# Altium schematic sheet Main_Core.SchDoc: PSDK&RFID_Ver_01
size A4; Date: 2020年12月23日
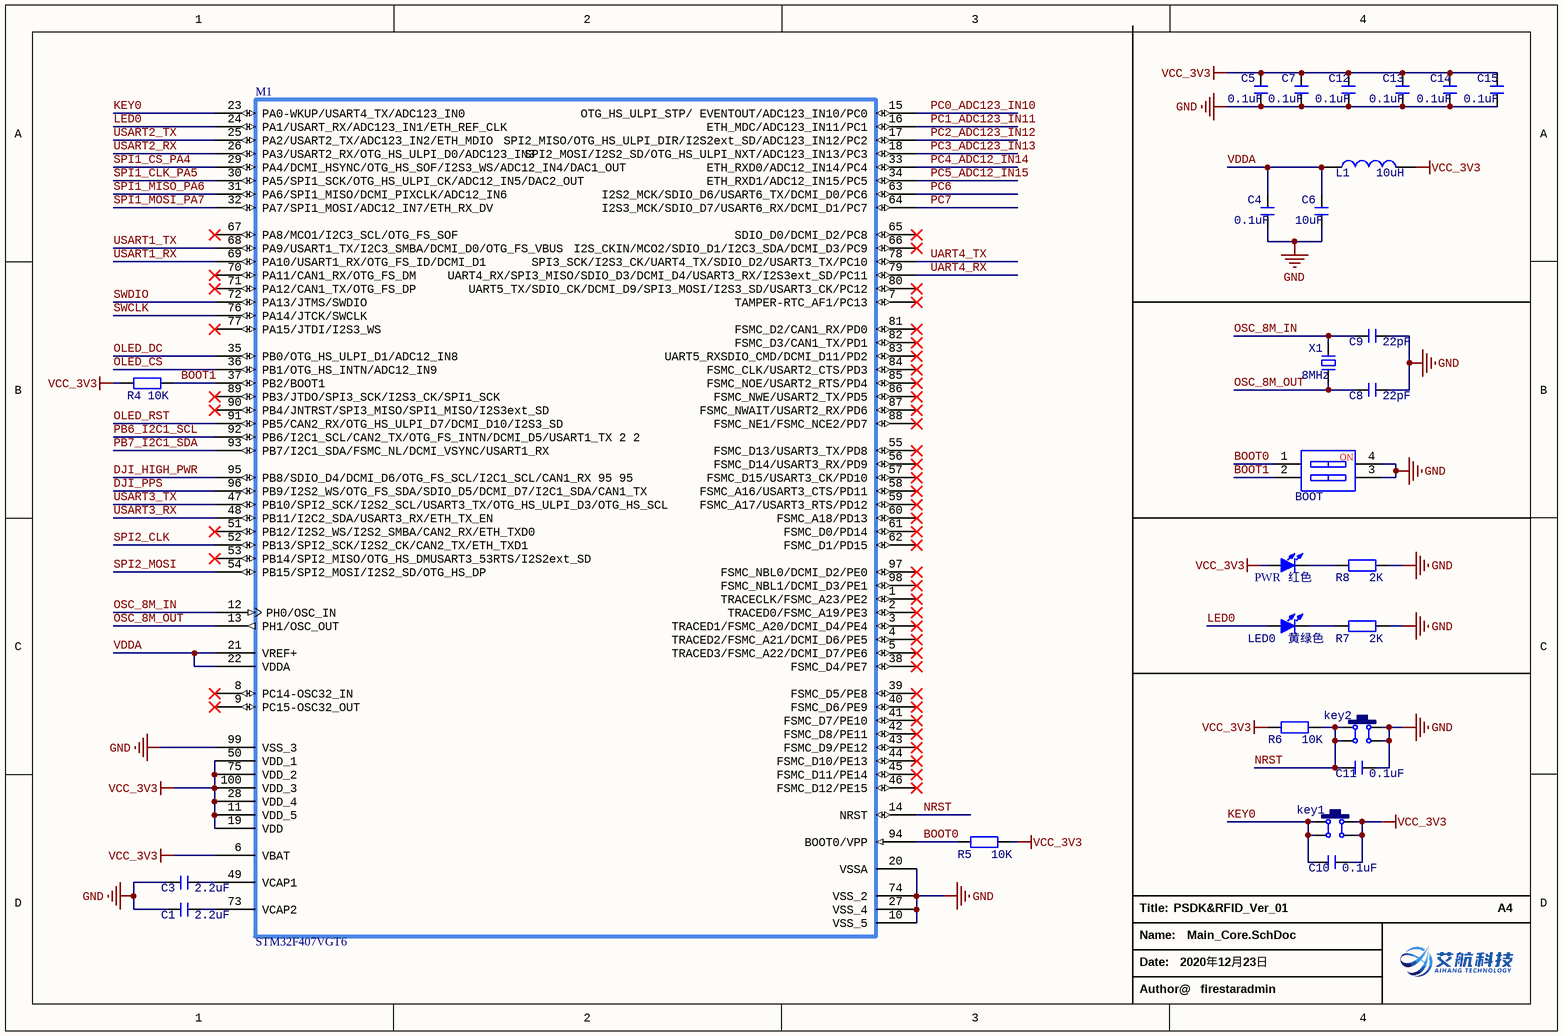
[diagram p0: Main_Core.SchDoc]

## Parts
BOOT  CSW-2P  [CSW1.27 SMD-2P]  (value not drawn)
C1  2.2uF  [C 0603_L]
C3  2.2uF  [C 0603_L]
C4  0.1uF  [C 0603_L]
C5  0.1uF  [C 0603_L]
C6  10uF  [C 0603_L]
C7  0.1uF  [C 0603_L]
C8  22pF  [C 0603_L]
C9  22pF  [C 0603_L]
C10  0.1uF  [C 0603_L]
C11  0.1uF  [C 0603_L]
C12  0.1uF  [C 0603_L]
C13  0.1uF  [C 0603_L]
C14  0.1uF  [C 0603_L]
C15  0.1uF  [C 0603_L]
key1  key  [TSMD-3*4*2.5]  (value not drawn)
key2  key  [TSMD-3*4*2.5]  (value not drawn)
L1  10uH  [L 0603]
LED0  黄绿色  [LED 0603G]
M1  STM32F407VGT6  [LQFP100 14x14_M]
PWR  红色  [LED 0603R]
R4  10K  [R 0603_L]
R5  10K  [R 0603_L]
R6  10K  [R 0603_L]
R7  2K  [R 0603_L]
R8  2K  [R 0603_L]
X1  8MHz  [OSC 5032-2P]

## Nets
GND: BOOT.3 BOOT.4 C1.2 C3.2 C4.1 C5.1 C6.1 C7.1 C8.1 C9.1 C11.1 C12.1 C13.1 C14.1 C15.1 key2.3 key2.4 M1.10(VSS_5) M1.20(VSSA) M1.27(VSS_4) M1.74(VSS_2) M1.99(VSS_3) R7.2 R8.2
VCC_3V3: C5.2 C7.2 C10.1 C12.2 C13.2 C14.2 C15.2 key1.3 key1.4 L1.2 M1.6(VBAT) M1.11(VDD_5) M1.19(VDD) M1.28(VDD_4) M1.50(VDD_1) M1.75(VDD_2) M1.100(VDD_3) PWR.1(A) R4.2 R5.2 R6.1
BOOT0: BOOT.1 M1.94(BOOT0/VPP) R5.1
BOOT1: BOOT.2 M1.37(PB2/BOOT1) R4.1
DJI_HIGH_PWR: M1.95(PB8/SDIO_D4/DCMI_D6/OTG_FS_SCL/I2C1_SCL/CAN1_RX_95_95)
DJI_PPS: M1.96(PB9/I2S2_WS/OTG_FS_SDA/SDIO_D5/DCMI_D7/I2C1_SDA/CAN1_TX)
KEY0: C10.2 key1.1 key1.2 M1.23(PA0-WKUP/USART4_TX/ADC123_IN0)
LED0: LED0.1(A) M1.24(PA1/USART_RX/ADC123_IN1/ETH_REF_CLK)
NRST: C11.2 key2.1 key2.2 M1.14(NRST) R6.2
OLED_CS: M1.36(PB1/OTG_HS_INTN/ADC12_IN9)
OLED_DC: M1.35(PB0/OTG_HS_ULPI_D1/ADC12_IN8)
OLED_RST: M1.91(PB5/CAN2_RX/OTG_HS_ULPI_D7/DCMI_D10/I2S3_SD)
OSC_8M_IN: C9.2 M1.12(PH0/OSC_IN) X1.2
OSC_8M_OUT: C8.2 M1.13(PH1/OSC_OUT) X1.1
PB6_I2C1_SCL: M1.92(PB6/I2C1_SCL/CAN2_TX/OTG_FS_INTN/DCMI_D5/USART1_TX_2_2)
PB7_I2C1_SDA: M1.93(PB7/I2C1_SDA/FSMC_NL/DCMI_VSYNC/USART1_RX)
PC0_ADC123_IN10: M1.15(OTG_HS_ULPI_STP/_EVENTOUT/ADC123_IN10/PC0)
PC1_ADC123_IN11: M1.16(ETH_MDC/ADC123_IN11/PC1)
PC2_ADC123_IN12: M1.17(SPI2_MISO/OTG_HS_ULPI_DIR/I2S2ext_SD/ADC123_IN12/PC2)
PC3_ADC123_IN13: M1.18(SPI2_MOSI/I2S2_SD/OTG_HS_ULPI_NXT/ADC123_IN13/PC3)
PC4_ADC12_IN14: M1.33(ETH_RXD0/ADC12_IN14/PC4)
PC5_ADC12_IN15: M1.34(ETH_RXD1/ADC12_IN15/PC5)
PC6: M1.63(I2S2_MCK/SDIO_D6/USART6_TX/DCMI_D0/PC6)
PC7: M1.64(I2S3_MCK/SDIO_D7/USART6_RX/DCMI_D1/PC7)
SPI1_CLK_PA5: M1.30(PA5/SPI1_SCK/OTG_HS_ULPI_CK/ADC12_IN5/DAC2_OUT)
SPI1_CS_PA4: M1.29(PA4/DCMI_HSYNC/OTG_HS_SOF/I2S3_WS/ADC12_IN4/DAC1_OUT)
SPI1_MISO_PA6: M1.31(PA6/SPI1_MISO/DCMI_PIXCLK/ADC12_IN6)
SPI1_MOSI_PA7: M1.32(PA7/SPI1_MOSI/ADC12_IN7/ETH_RX_DV)
SPI2_CLK: M1.52(PB13/SPI2_SCK/I2S2_CK/CAN2_TX/ETH_TXD1)
SPI2_MOSI: M1.54(PB15/SPI2_MOSI/I2S2_SD/OTG_HS_DP)
SWCLK: M1.76(PA14/JTCK/SWCLK)
SWDIO: M1.72(PA13/JTMS/SWDIO)
UART4_RX: M1.79(UART4_RX/SPI3_MISO/SDIO_D3/DCMI_D4/USART3_RX/I2S3ext_SD/PC11)
UART4_TX: M1.78(SPI3_SCK/I2S3_CK/UART4_TX/SDIO_D2/USART3_TX/PC10)
USART1_RX: M1.69(PA10/USART1_RX/OTG_FS_ID/DCMI_D1)
USART1_TX: M1.68(PA9/USART1_TX/I2C3_SMBA/DCMI_D0/OTG_FS_VBUS)
USART2_RX: M1.26(PA3/USART2_RX/OTG_HS_ULPI_D0/ADC123_IN3)
USART2_TX: M1.25(PA2/USART2_TX/ADC123_IN2/ETH_MDIO)
USART3_RX: M1.48(PB11/I2C2_SDA/USART3_RX/ETH_TX_EN)
USART3_TX: M1.47(PB10/SPI2_SCK/I2S2_SCL/USART3_TX/OTG_HS_ULPI_D3/OTG_HS_SCL)
VDDA: C4.2 C6.2 L1.1 M1.21(VREF+) M1.22(VDDA)
NetC1_1: C1.1 M1.73(VCAP2)
NetC3_1: C3.1 M1.49(VCAP1)
NetLED0_2: LED0.2(K) R7.1
NetPWR_2: PWR.2(K) R8.1

Not connected (* = marked no-connect by the designer): M1 1(TRACECLK/FSMC_A23/PE2)* 2(TRACED0/FSMC_A19/PE3)* 3(TRACED1/FSMC_A20/DCMI_D4/PE4)* 4(TRACED2/FSMC_A21/DCMI_D6/PE5)* 5(TRACED3/FSMC_A22/DCMI_D7/PE6)* 7(TAMPER-RTC_AF1/PC13)* 8(PC14-OSC32_IN)* 9(PC15-OSC32_OUT)* 38(FSMC_D4/PE7)* 39(FSMC_D5/PE8)* 40(FSMC_D6/PE9)* 41(FSMC_D7/PE10)* 42(FSMC_D8/PE11)* 43(FSMC_D9/PE12)* 44(FSMC_D10/PE13)* 45(FSMC_D11/PE14)* 46(FSMC_D12/PE15)* 51(PB12/I2S2_WS/I2S2_SMBA/CAN2_RX/ETH_TXD0)* 53(PB14/SPI2_MISO/OTG_HS_DMUSART3_53RTS/I2S2ext_SD)* 55(FSMC_D13/USART3_TX/PD8)* 56(FSMC_D14/USART3_RX/PD9)* 57(FSMC_D15/USART3_CK/PD10)* 58(FSMC_A16/USART3_CTS/PD11)* 59(FSMC_A17/USART3_RTS/PD12)* 60(FSMC_A18/PD13)* 61(FSMC_D0/PD14)* 62(FSMC_D1/PD15)* 65(SDIO_D0/DCMI_D2/PC8)* 66(I2S_CKIN/MCO2/SDIO_D1/I2C3_SDA/DCMI_D3/PC9)* 67(PA8/MCO1/I2C3_SCL/OTG_FS_SOF)* 70(PA11/CAN1_RX/OTG_FS_DM)* 71(PA12/CAN1_TX/OTG_FS_DP)* 77(PA15/JTDI/I2S3_WS)* 80(UART5_TX/SDIO_CK/DCMI_D9/SPI3_MOSI/I2S3_SD/USART3_CK/PC12)* 81(FSMC_D2/CAN1_RX/PD0)* 82(FSMC_D3/CAN1_TX/PD1)* 83(UART5_RXSDIO_CMD/DCMI_D11/PD2)* 84(FSMC_CLK/USART2_CTS/PD3)* 85(FSMC_NOE/USART2_RTS/PD4)* 86(FSMC_NWE/USART2_TX/PD5)* 87(FSMC_NWAIT/USART2_RX/PD6)* 88(FSMC_NE1/FSMC_NCE2/PD7)* 89(PB3/JTDO/SPI3_SCK/I2S3_CK/SPI1_SCK)* 90(PB4/JNTRST/SPI3_MISO/SPI1_MISO/I2S3ext_SD)* 97(FSMC_NBL0/DCMI_D2/PE0)* 98(FSMC_NBL1/DCMI_D3/PE1)*

## Notes on the sheet
- Title:
- A4
- Name:
- Date:
- Author@
- firestaradmin
- (in symbol CSW-2P) NO

## Library data of the parts
BOOT = CSW-2P: 2路编码开关; 版权归属: 源创客; BOM名称: 2路编码开关; 学习资源: www.ooocke.com
C1 C3-C15 = C: 无极性贴片电容; 版权归属: 源创客; BOM名称: 无极性贴片电容; 学习资源: www.ooocke.com
key1 key2 = TS-3x4x2.5mm-4pin: TS-3x4x2.5mm-4pin 轻触按键
L1 = L: 小功率贴片电感; 版权归属: 源创客; BOM名称: 小功率贴片电感; 学习资源: www.ooocke.com
LED0 PWR = LED-SMD: 贴片LED; 版权归属: 源创客; BOM名称: 贴片LED; 学习资源: www.ooocke.com
M1 = STM32F407VGT6: LQFP100，ARM®-Cortex®-M4-series-微控制器-IC-32-位-168MHz-1MB Flash，192KB SRAM.  IO:82
R4-R8 = R: 贴片电阻; 版权归属: 源创客; BOM名称: 贴片电阻; 学习资源: www.ooocke.com
X1 = XTAL-2P: 2脚无源脚晶振; 版权归属: 源创客; BOM名称: 2脚无源脚晶振; 学习资源: www.ooocke.com